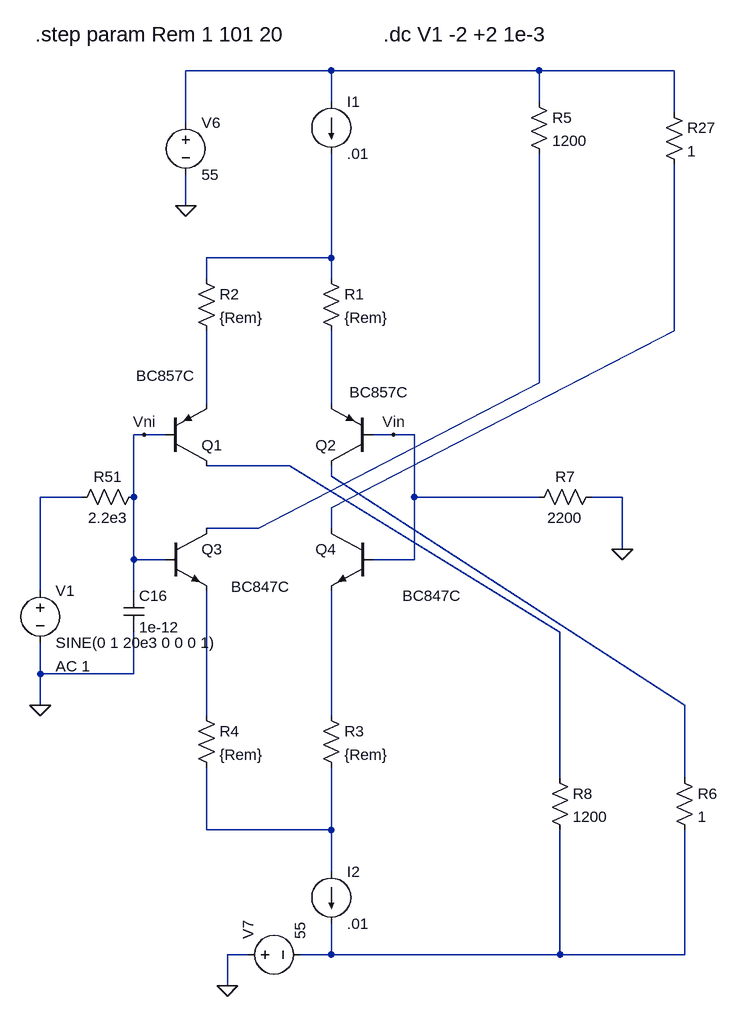
[diagram p0: schematic LTP input overload_1.asc]
LTP input overload_1.asc, the LTspice schematic file:
Version 4
SHEET 1 3116 1140
WIRE 272 -464 48 -464
WIRE 592 -464 272 -464
WIRE 800 -464 592 -464
WIRE 272 -416 272 -464
WIRE 592 -416 592 -464
WIRE 800 -400 800 -464
WIRE 48 -384 48 -464
WIRE 48 -256 48 -304
WIRE 272 -176 272 -336
WIRE 272 -176 80 -176
WIRE 80 -144 80 -176
WIRE 272 -144 272 -176
WIRE 800 -64 800 -320
WIRE 592 16 592 -336
WIRE 80 48 80 -64
WIRE 272 48 272 -64
WIRE -16 96 -32 96
WIRE 16 96 -16 96
WIRE 368 96 336 96
WIRE 400 96 368 96
WIRE 208 144 80 144
WIRE 272 160 272 144
WIRE -112 192 -176 192
WIRE -32 192 -32 96
WIRE 400 192 400 96
WIRE 592 192 400 192
WIRE 720 192 672 192
WIRE 272 208 800 -64
WIRE 160 240 592 16
WIRE 160 240 80 240
WIRE 272 240 272 208
WIRE 720 272 720 192
WIRE -32 288 -32 192
WIRE 16 288 -32 288
WIRE 400 288 400 192
WIRE 400 288 336 288
WIRE -176 336 -176 192
WIRE -32 336 -32 288
WIRE 624 400 208 144
WIRE -176 464 -176 416
WIRE -32 464 -32 400
WIRE -32 464 -176 464
WIRE -176 512 -176 464
WIRE 816 512 272 160
WIRE 80 528 80 336
WIRE 272 528 272 336
WIRE 624 624 624 400
WIRE 816 624 816 512
WIRE 80 704 80 608
WIRE 272 704 272 608
WIRE 272 704 80 704
WIRE 272 768 272 704
WIRE 144 896 112 896
WIRE 272 896 272 848
WIRE 272 896 224 896
WIRE 624 896 624 704
WIRE 624 896 272 896
WIRE 816 896 816 704
WIRE 816 896 624 896
WIRE 112 944 112 896
FLAG 48 -256 0
FLAG -176 512 0
FLAG 112 944 0
FLAG -16 96 Vni
FLAG 368 96 Vin
FLAG 720 272 0
SYMBOL pnp 16 144 M180
WINDOW 3 284 113 Left 2
SYMATTR Value BC857C
SYMATTR InstName Q1
SYMBOL pnp 336 144 R180
WINDOW 3 274 139 Left 2
SYMATTR Value BC857C
SYMATTR InstName Q2
SYMBOL npn 16 240 R0
WINDOW 3 102 90 Left 2
SYMATTR Value BC847C
SYMATTR InstName Q3
SYMBOL npn 336 240 M0
WINDOW 3 -136 104 Left 2
SYMATTR Value BC847C
SYMATTR InstName Q4
SYMBOL res 64 -160 R0
SYMATTR InstName R2
SYMATTR Value {Rem}
SYMBOL res 576 -432 R0
SYMATTR InstName R5
SYMATTR Value 1200
SYMBOL res 608 608 R0
SYMATTR InstName R8
SYMATTR Value 1200
SYMBOL voltage 48 -400 R0
WINDOW 123 0 0 Left 2
WINDOW 39 0 0 Left 2
SYMATTR InstName V6
SYMATTR Value 55
SYMBOL voltage 128 896 R270
WINDOW 123 0 0 Left 2
WINDOW 39 0 0 Left 2
SYMATTR InstName V7
SYMATTR Value 55
SYMBOL res -16 176 R90
WINDOW 0 0 56 VBottom 2
WINDOW 3 32 56 VTop 2
SYMATTR InstName R51
SYMATTR Value 2.2e3
SYMBOL cap -48 336 R0
SYMATTR InstName C16
SYMATTR Value 1e-12
SYMBOL voltage -176 320 R0
WINDOW 123 24 132 Left 2
WINDOW 39 0 0 Left 2
SYMATTR Value2 AC 1
SYMATTR InstName V1
SYMATTR Value SINE(0 1 20e3 0 0 0 1)
SYMBOL current 272 -416 R0
WINDOW 123 0 0 Left 2
WINDOW 39 0 0 Left 2
SYMATTR InstName I1
SYMATTR Value .01
SYMBOL current 272 768 R0
WINDOW 123 0 0 Left 2
WINDOW 39 0 0 Left 2
SYMATTR InstName I2
SYMATTR Value .01
SYMBOL res 784 -416 R0
SYMATTR InstName R27
SYMATTR Value 1
SYMBOL res 800 608 R0
SYMATTR InstName R6
SYMATTR Value 1
SYMBOL res 688 176 R90
WINDOW 0 0 56 VBottom 2
WINDOW 3 32 56 VTop 2
SYMATTR InstName R7
SYMATTR Value 2200
SYMBOL res 256 -160 R0
SYMATTR InstName R1
SYMATTR Value {Rem}
SYMBOL res 256 512 R0
SYMATTR InstName R3
SYMATTR Value {Rem}
SYMBOL res 64 512 R0
SYMATTR InstName R4
SYMATTR Value {Rem}
TEXT 352 -520 Left 3 !.dc V1 -2 +2 1e-3
TEXT -184 -520 Left 3 !.step param Rem 1 101 20

The netlist it stands for:
* LTP input overload_1.asc
Q1 N007 Vni N005 0 BC857C
Q2 N008 Vin N006 0 BC857C
Q3 N004 Vni N010 0 BC847C
Q4 N003 Vin N011 0 BC847C
R2 N002 N005 {Rem}
R5 N001 N004 1200
R8 N007 N013 1200
V6 N001 0 55
V7 0 N013 55
R51 Vni N009 2.2e3
C16 Vni 0 1e-12
V1 N009 0 SINE(0 1 20e3 0 0 0 1) AC 1
I1 N001 N002 .01
I2 N012 N013 .01
R27 N001 N003 1
R6 N008 N013 1
R7 0 Vin 2200
R1 N002 N006 {Rem}
R3 N011 N012 {Rem}
R4 N010 N012 {Rem}
.model NPN NPN
.model PNP PNP
.lib standard.bjt
.dc V1 -2 +2 1e-3
.step param Rem 1 101 20
.backanno
.end